# Altium schematic sheet BTB_CONN.SchDoc: =project_title
size Tabloid; CompanyName: Luxonis Holding; Organization: Luxonis Holding; Address1: 1925 Harmony Park Drive; Address2: Westminster, CO; Address3: 80234; Address4: United States; SheetNumber: 3; SheetTotal: 14
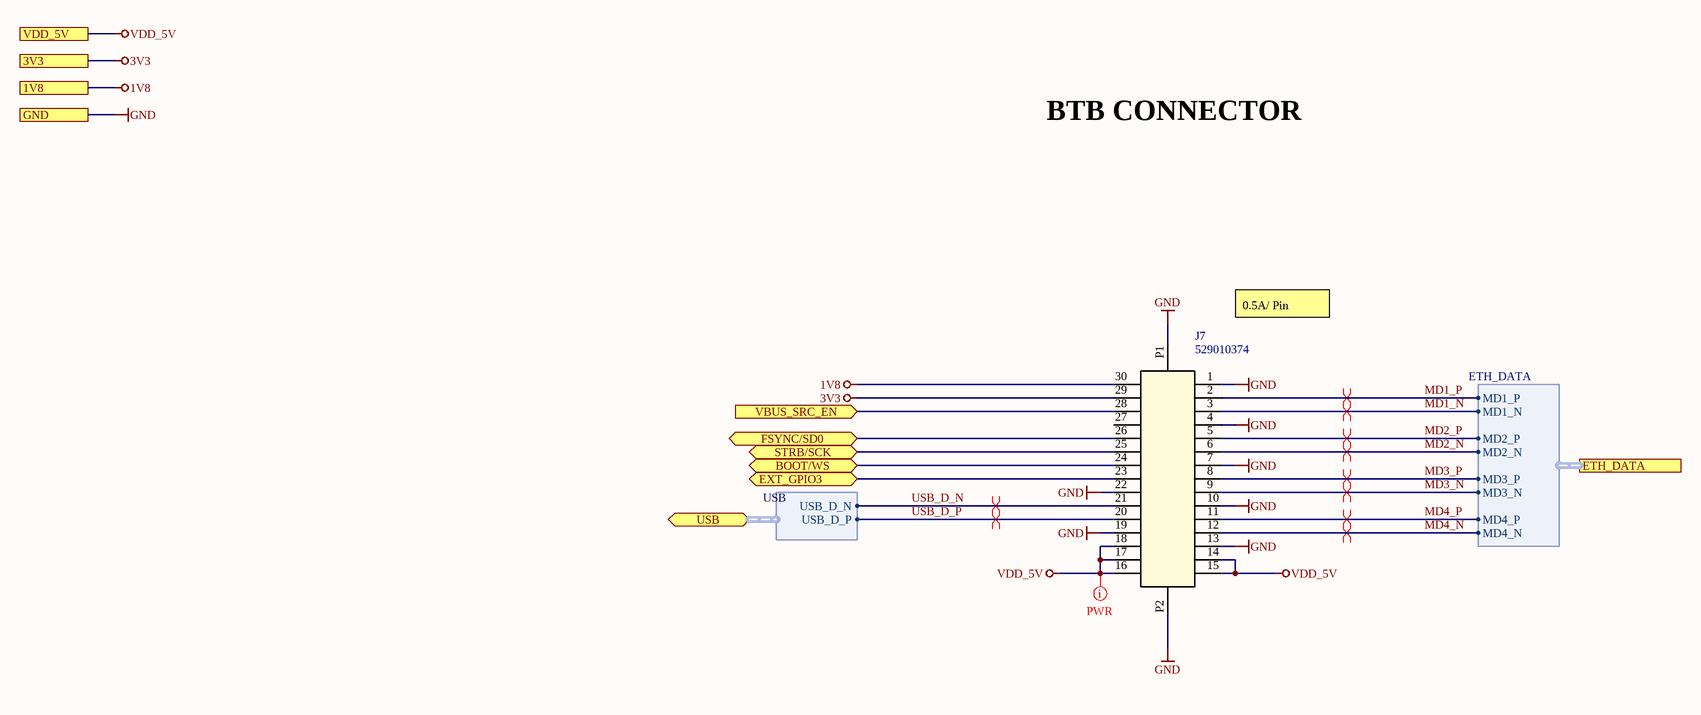
[diagram p0: BTB_CONN.SchDoc]

## Parts
J7  529010374  [CON_529010374]

## Ports
1V8, 3V3, BOOT/WS (bidir), ETH_DATA (harness ETH_DATA), EXT_GPIO3 (bidir), FSYNC/SD0 (bidir), GND, STRB/SCK (bidir), USB (bidir, harness USB), VBUS_SRC_EN (in), VDD_5V

## Harnesses
ETH_DATA: MD1_P, MD1_N, MD2_P, MD2_N, MD3_P, MD3_N, MD4_P, MD4_N
USB: USB_D_P, USB_D_N

## Nets
1V8: J7.30 ; port 1V8
3V3: J7.29 ; port 3V3
GND: J7.1 J7.4 J7.7 J7.10 J7.13 J7.19 J7.22 J7.P1 J7.P2 ; port GND
VDD_5V: J7.14 J7.15 J7.16 J7.17 J7.18 ; port VDD_5V
BOOT/WS: J7.24 ; port BOOT/WS
EXT_GPIO3: J7.23 ; port EXT_GPIO3
FSYNC/SD0: J7.26 ; port FSYNC/SD0
MD1_N: J7.3 ; port ETH_DATA.MD1_N
MD1_P: J7.2 ; port ETH_DATA.MD1_P
MD2_N: J7.6 ; port ETH_DATA.MD2_N
MD2_P: J7.5 ; port ETH_DATA.MD2_P
MD3_N: J7.9 ; port ETH_DATA.MD3_N
MD3_P: J7.8 ; port ETH_DATA.MD3_P
MD4_N: J7.12 ; port ETH_DATA.MD4_N
MD4_P: J7.11 ; port ETH_DATA.MD4_P
STRB/SCK: J7.25 ; port STRB/SCK
USB_D_N: J7.21 ; port USB.USB_D_N
USB_D_P: J7.20 ; port USB.USB_D_P
VBUS_SRC_EN: J7.28 ; port VBUS_SRC_EN

Not connected (* = marked no-connect by the designer): J7 27

## Layout directives
differential pair; net class USB2; differential pair class 85ohm: USB_D_N, USB_D_P
differential pair; net class ETH; differential pair class 100ohm: MD1_N, MD1_P, MD2_N, MD2_P, MD3_N, MD3_P, MD4_N, MD4_P
net class PWR; Current Rating: 3A: VDD_5V

## Notes on the sheet
- BTB CONNECTOR
- 0.5A/ Pin
- Title
- Size:
- Date:
- Tabloid
- Number:
- Time:
- Revision:
- Sheet
- of
- Drawn by:

## Library data of the parts
J7 = CMP-002-00150-3: CONN, Board-to-Board Connector, Mezzanine, 0.635mm pitch, 2x15, 30 positions, Receptacle, Mated height 12 to 16mm; Manufacturer 1: Molex; Connector Type: BOARD STACKING CONNECTOR; Max Current Rating: 500mA; Voltage Rating: 100V; Manufacturer Part Number 1: 529010374; Pins: 2x15; Min Operating Temperature: -55°C; Max Operating Temperature: 105°C; Mounting Technology: Board; System: Connector